# Altium schematic sheet MCU.SchDoc: MCU
size A4; Author: João Guimarães; Revision: 2.0; SheetNumber: 3; SheetTotal: 9
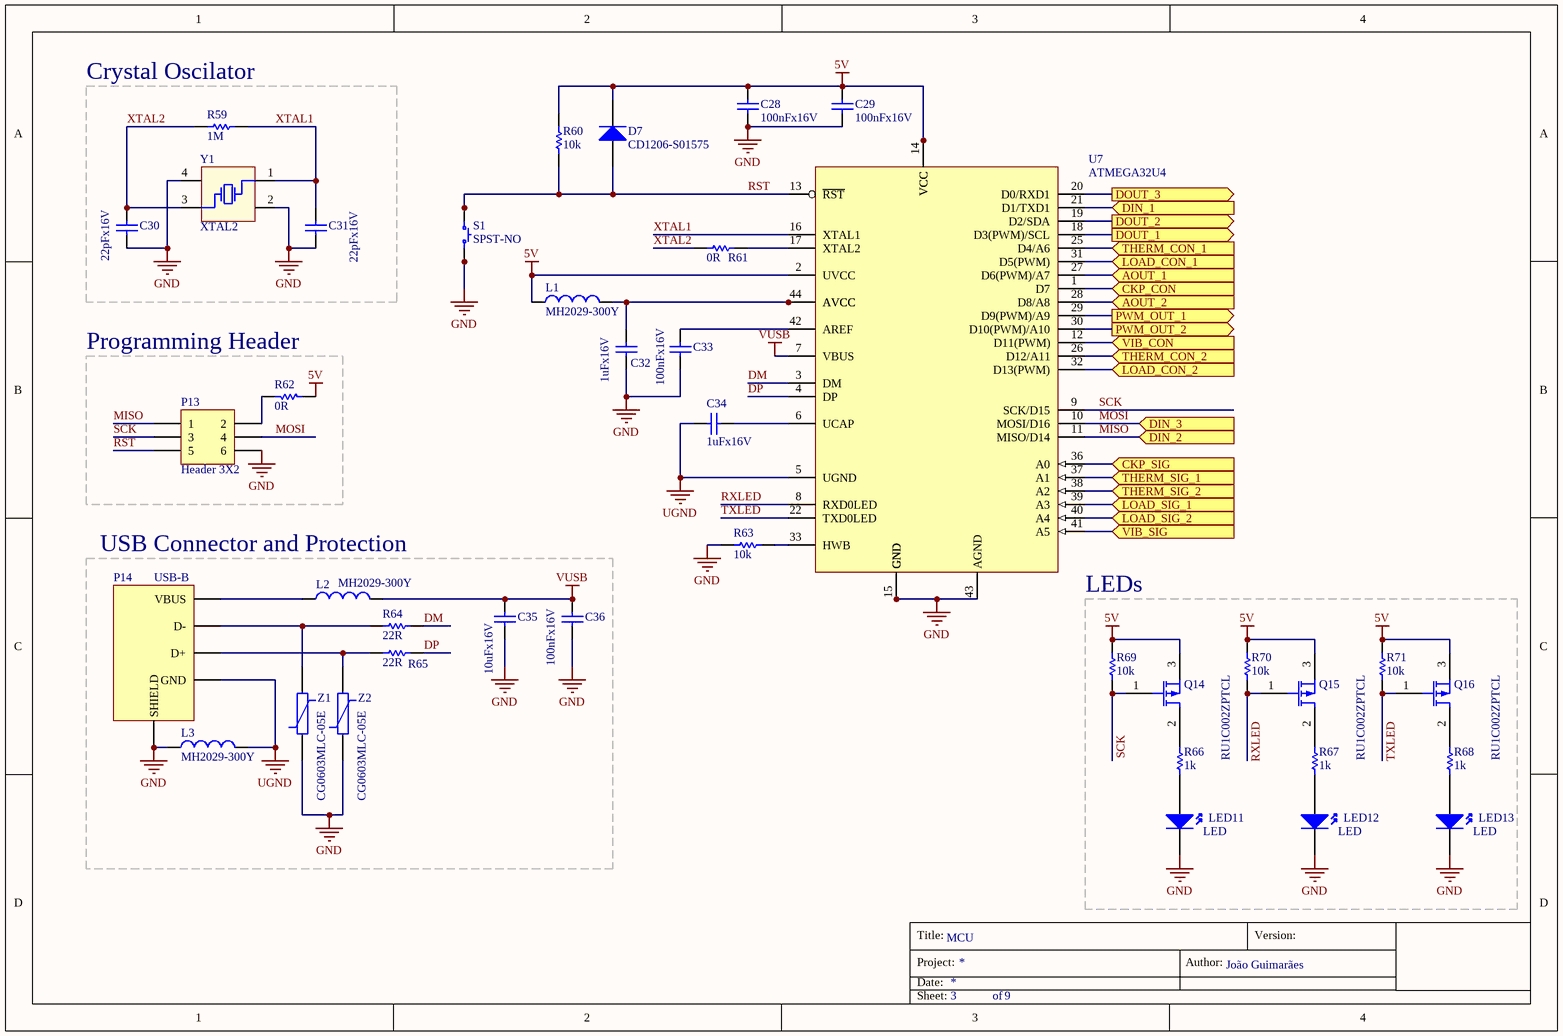
[diagram p0: MCU.SchDoc]

## Parts
C28  100nFx16V  [DISC-0805]
C29  100nFx16V  [DISC-0805]
C30  22pFx16V  [DISC-0805]
C31  22pFx16V  [DISC-0805]
C32  1uFx16V  [DISC-0805]
C33  100nFx16V  [DISC-0805]
C34  1uFx16V  [DISC-0805]
C35  10uFx16V  [DISC-0805]
C36  100nFx16V  [DISC-0805]
D7  CD1206-S01575  [DISC-1206]
L1  MH2029-300Y  [DISC-0805]
L2  MH2029-300Y  [DISC-0805]
L3  MH2029-300Y  [DISC-0805]
LED11  LED  [DISC-LED-0.1-PTH]
LED12  LED  [DISC-LED-0.1-PTH]
LED13  LED  [DISC-LED-0.1-PTH]
P13  Header 3X2  [CON-HEADER-2X3-PTH]
P14  USB-B  [CON-USB-B]
Q14  RU1C002ZPTCL  [DISC-SOT-23]
Q15  RU1C002ZPTCL  [DISC-SOT-23]
Q16  RU1C002ZPTCL  [DISC-SOT-23]
R59  1M  [DISC-0805]
R60  10k  [DISC-0805]
R61  0R  [DISC-0805]
R62  0R  [DISC-0805]
R63  10k  [DISC-0805]
R64  22R  [DISC-0805]
R65  22R  [DISC-0805]
R66  1k  [DISC-0805]
R67  1k  [DISC-0805]
R68  1k  [DISC-0805]
R69  10k  [DISC-0805]
R70  10k  [DISC-0805]
R71  10k  [DISC-0805]
S1  SPST-NO  [DISC-PUSHBUTTON-4P-SMD]
U7  ATMEGA32U4  [CI-QFP-44]
Y1  XTAL2  [DISC-CRYSTAL-4P-3.2X2.5]
Z1  CG0603MLC-05E  [DISC-0603]
Z2  CG0603MLC-05E  [DISC-0603]

## Blocks framed on the sheet
Crystal Oscilator: C30 C31 R59 Y1
Programming Header: P13 R62
USB Connector and Protection: C35 C36 L2 L3 P14 R64 R65 Z1 Z2
LEDs: LED11-LED13 Q14-Q16 R66-R71

## Ports
AOUT_1 (in), AOUT_2 (in), CKP_CON (in), CKP_SIG (in), DIN_1 (in), DIN_2 (in), DIN_3 (in), DOUT_1 (out), DOUT_2 (out), DOUT_3 (out), LOAD_CON_1 (in), LOAD_CON_2 (in), LOAD_SIG_1 (in), LOAD_SIG_2 (in), PWM_OUT_1 (out), PWM_OUT_2 (out), THERM_CON_1 (in), THERM_CON_2 (in), THERM_SIG_1 (in), THERM_SIG_2 (in), VIB_CON (in), VIB_SIG (in)

## Nets
5V: C28.1 C29.1 D7.2(K) L1.1 Q14.3(S) Q15.3(S) Q16.3(S) R60.1 R62.2 R69.1 R70.1 R71.1 U7.2(UVCC) U7.14(VCC) U7.34(VCC)
GND: C28.2 C29.2 C30.1 C31.1 C32.2 C33.2 C35.2 C36.2 L3.1 LED11.2(K) LED12.2(K) LED13.2(K) P13.6 P14.5(SHIELD) P14.6(SHIELD) R63.1 S1.1 S1.2 U7.15(GND) U7.23(GND) U7.35(GND) U7.43(AGND) Y1.2(GND) Y1.4(GND) Z1.1 Z2.1
UGND: C34.1 L3.2 P14.4(GND) U7.5(UGND)
VUSB: C35.1 C36.1 L2.2 U7.7(VBUS)
AOUT_1: U7.27(D6(PWM)/A7) ; port AOUT_1
AOUT_2: U7.28(D8/A8) ; port AOUT_2
CKP_CON: U7.1(D7) ; port CKP_CON
CKP_SIG: U7.36(A0) ; port CKP_SIG
DIN_1: U7.21(D1/TXD1) ; port DIN_1
DM: R64.2 U7.3(DM)
DOUT_1: U7.18(D3(PWM)/SCL) ; port DOUT_1
DOUT_2: U7.19(D2/SDA) ; port DOUT_2
DOUT_3: U7.20(D0/RXD1) ; port DOUT_3
DP: R65.2 U7.4(DP)
LOAD_CON_1: U7.31(D5(PWM)) ; port LOAD_CON_1
LOAD_CON_2: U7.32(D13(PWM)) ; port LOAD_CON_2
LOAD_SIG_1: U7.39(A3) ; port LOAD_SIG_1
LOAD_SIG_2: U7.40(A4) ; port LOAD_SIG_2
MISO: P13.1 U7.11(MISO/D14) ; port DIN_2
MOSI: P13.4 U7.10(MOSI/D16) ; port DIN_3
PWM_OUT_1: U7.29(D9(PWM)/A9) ; port PWM_OUT_1
PWM_OUT_2: U7.30(D10(PWM)/A10) ; port PWM_OUT_2
RST: D7.1(A) P13.5 R60.2 S1.3 S1.4 U7.13(~{RST})
RXLED: Q15.1(G) R70.2 U7.8(RXD0LED)
SCK: P13.3 Q14.1(G) R69.2 U7.9(SCK/D15)
THERM_CON_1: U7.25(D4/A6) ; port THERM_CON_1
THERM_CON_2: U7.26(D12/A11) ; port THERM_CON_2
THERM_SIG_1: U7.37(A1) ; port THERM_SIG_1
THERM_SIG_2: U7.38(A2) ; port THERM_SIG_2
TXLED: Q16.1(G) R71.2 U7.22(TXD0LED)
VIB_CON: U7.12(D11(PWM)) ; port VIB_CON
VIB_SIG: U7.41(A5) ; port VIB_SIG
XTAL1: C31.2 R59.2 U7.16(XTAL1) Y1.1(OSC1)
XTAL2: C30.2 R59.1 R61.1 Y1.3(OSC2)
NetC32_1: C32.1 L1.2 U7.24(AVCC) U7.44(AVCC)
NetC33_1: C33.1 U7.42(AREF)
NetC34_2: C34.2 U7.6(UCAP)
NetL2_1: L2.1 P14.1(VBUS)
NetLED11_1: LED11.1(A) R66.2
NetLED12_1: LED12.1(A) R67.2
NetLED13_1: LED13.1(A) R68.2
NetP13_2: P13.2 R62.1
NetP14_2: P14.2(D-) R64.1 Z1.2
NetP14_3: P14.3(D+) R65.1 Z2.2
NetQ14_2: Q14.2(D) R66.1
NetQ15_2: Q15.2(D) R67.1
NetQ16_2: Q16.2(D) R68.1
NetR61_2: R61.2 U7.17(XTAL2)
NetR63_2: R63.2 U7.33(HWB)

## Notes on the sheet
- Title:
- Project:
- Date:
- Author:
- Version:
- Sheet:
- of

## Library data of the parts
C28-C36 = Cap: Capacitor
D7 = Diode: Default Diode; Published: 8-Jun-2000; LatestRevisionDate: 17-Jul-2002; LatestRevisionNote: Re-released for DXP Platform.; PackageVersion: Sep-1996; PackageReference: SMC; Publisher: Altium Limited; PackageDescription: DO-214-AB/SMC; 2 C-Bend Leads; Body 7.9 x 5.9 mm, inc. leads (LxW); Code_JEDEC: DO-214-AB
L1-L3 = Inductor: Chip Inductor
P13 = Header 3X2: Header, 3-Pin, Dual row; LatestRevisionDate: 17-Jul-2002; LatestRevisionNote: Re-released for DXP Platform.; Publisher: Altium Limited
P14 = USB Type-B
Q14-Q16 = Transistor-PMOS: P-Channel MOSFET
R59-R71 = Res: Resistor
U7 = ATMEGA32U4-AU: 8-bit Microcontroller with 16/32K bytes of ISP Flash and  USB Controller
Y1 = XTAL-4-PIN
Z1 Z2 = Varistor